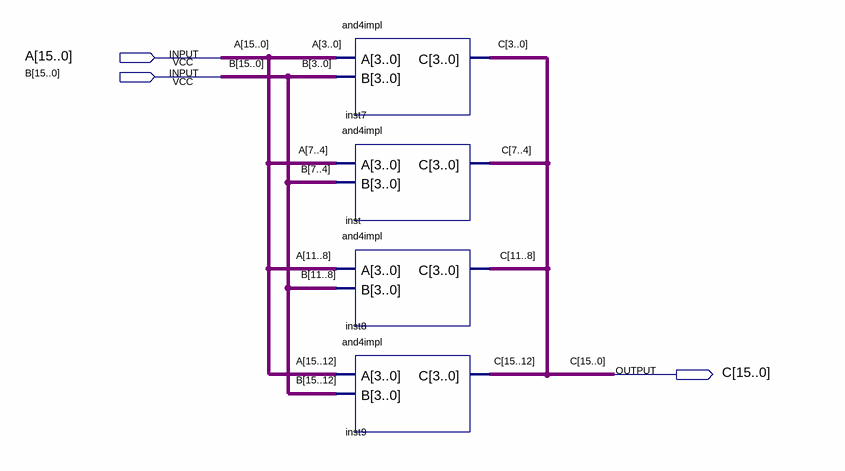
[diagram p0: schematic sheet]
// Quartus schematic and16.bdf as structural Verilog: 4 symbols, 3 pins
module and16 (
  input  [15:0] A,
  input  [15:0] B,
  output [15:0] C
);

  and4impl inst7 (.A(A[3:0]), .B(B[3:0]), .C(C[3:0]));
  and4impl inst (.A(A[7:4]), .B(B[7:4]), .C(C[7:4]));
  and4impl inst8 (.A(A[11:8]), .B(B[11:8]), .C(C[11:8]));
  and4impl inst9 (.A(A[15:12]), .B(B[15:12]), .C(C[15:12]));
endmodule
